# EAGLE design PCB_MASTER_CARRO_MYM (EAGLE 9.2.2)
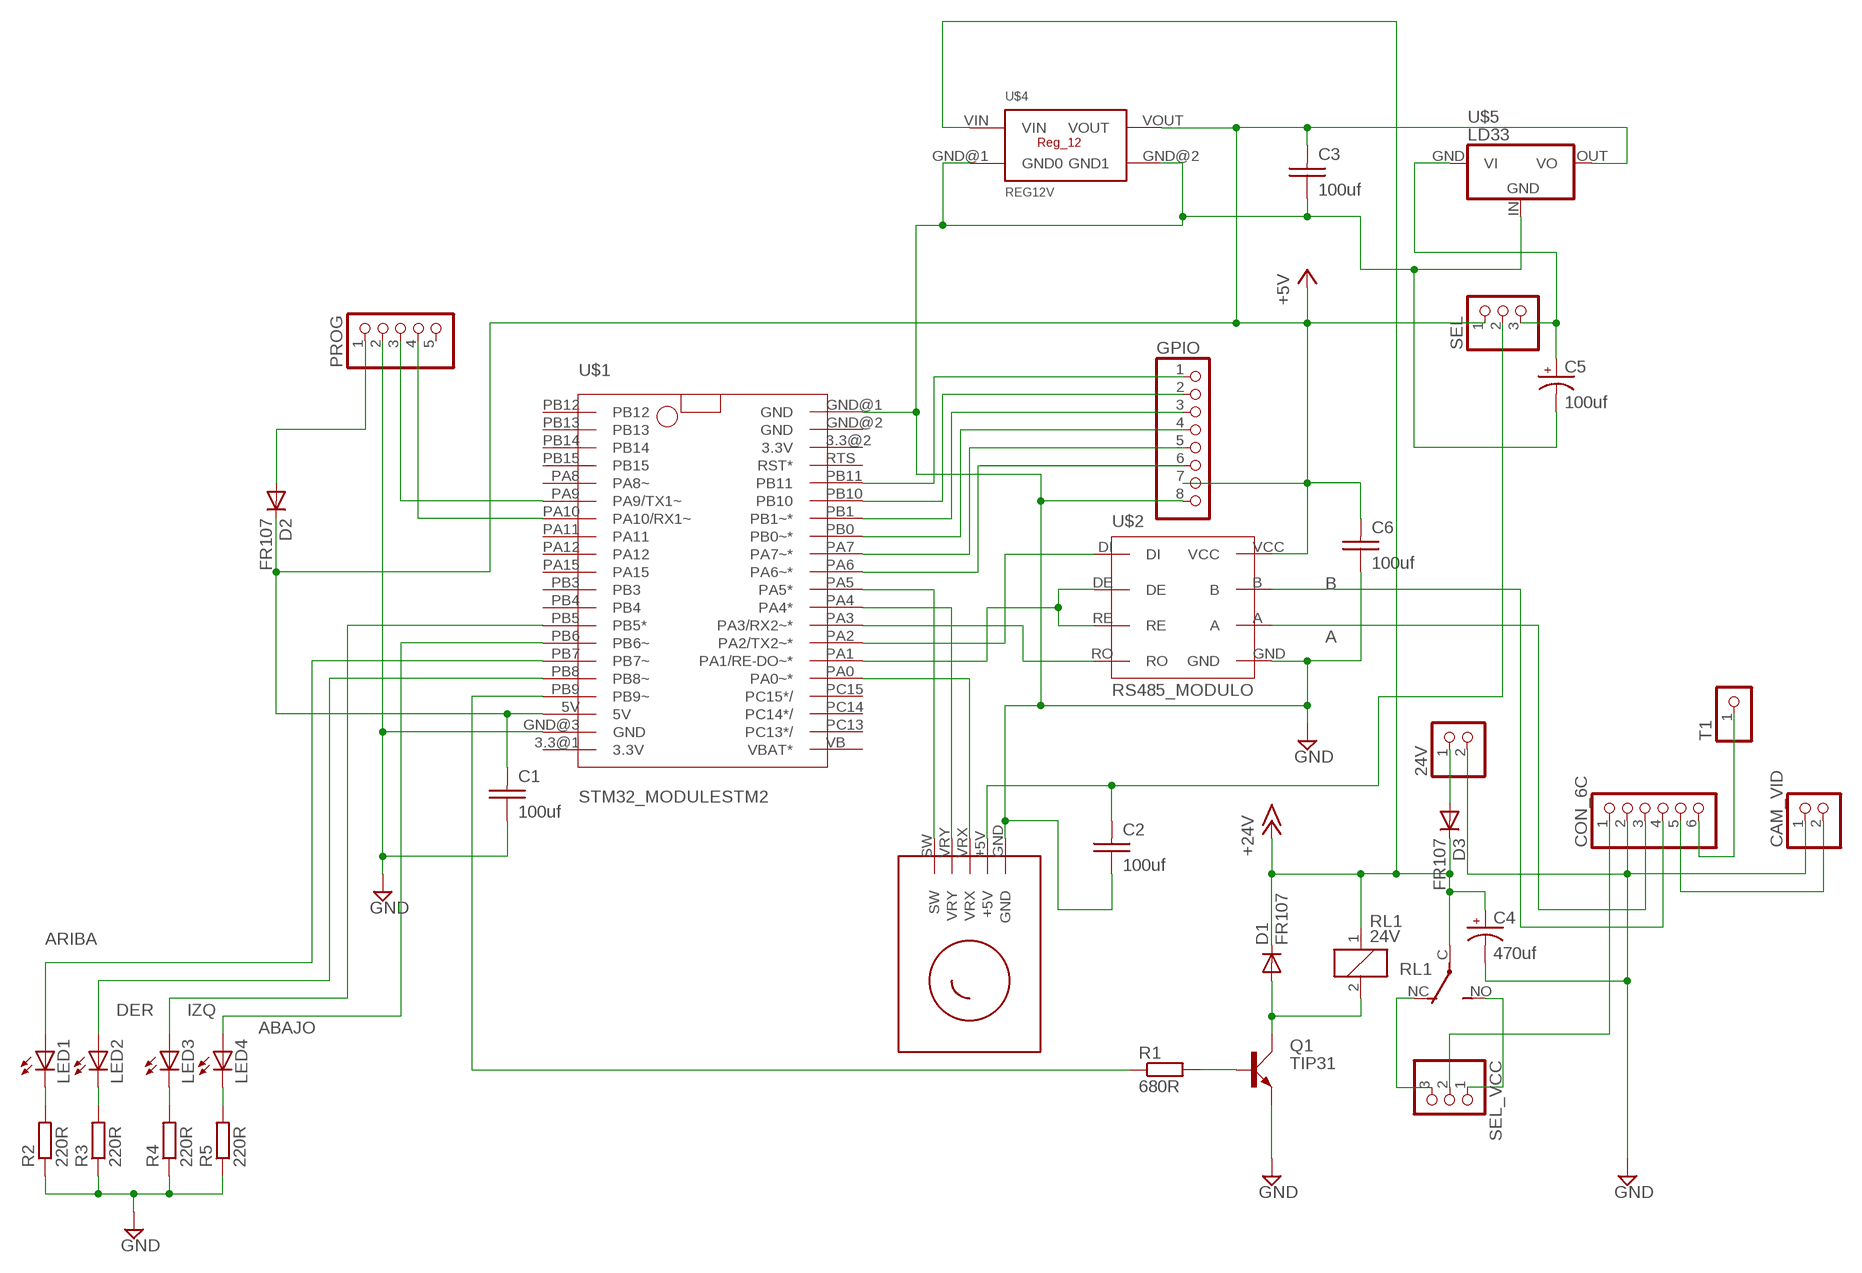
[diagram p0: schematic, sheet 1]

## Parts
24V  PINHD-1X2  [1X02]
C1  100uf  CAP_CERAMICO_TH2  [CAP_CER_2,54-5X5]
C2  100uf  CAP_CERAMICO_TH2  [CAP_CER_2,54-5X5]
C3  100uf  CAP_CERAMICO_TH2  [CAP_CER_2,54-5X5]
C4  470uf  CAP_POLARIZADOCAP_T5-8,5  [CAP_T_5-D8,5]
C5  100uf  CAP_POLARIZADOCAP_T3,5-D8  [CAP_T_3,5-D8]
C6  100uf  CAP_CERAMICO_TH2  [CAP_CER_2,54-5X5]
CAM_VID  PINHD-1X2  [1X02]
CON_6C  PINHD-1X6  [1X06]
D1  FR107  DIODOT_5  [D-5]
D2  FR107  DIODO  [DIODO4MM]
D3  FR107  DIODO  [DIODO4MM]
GPIO  PINHD-1X8  [1X08]
LED1  LEDLED_T_3MM  [LED3MM]
LED2  LEDLED_T_3MM  [LED3MM]
LED3  LEDLED_T_3MM  [LED3MM]
LED4  LEDLED_T_3MM  [LED3MM]
PROG  PINHD-1X5  [1X05]
Q1  TIP31  TIP48_TH  [TO220]
R1  680R  RESISTORT_LARGO  [0204/5]
R2  220R  RESISTORT_LARGO  [0204/5]
R3  220R  RESISTORT_LARGO  [0204/5]
R4  220R  RESISTORT_LARGO  [0204/5]
R5  220R  RESISTORT_LARGO  [0204/5]
RL1  24V  CQ1-12V  [CQ1]
SEL  PINHD-1X3  [1X03]
SEL_VCC  PINHD-1X3  [1X03]
T1  PINHD-1X1  [1X01]
U$1  STM32_MODULESTM2  [STM_32MOD]
U$2  RS485_MODULO  [RS485_FP]
U$3  JOYSTICK  [JOYSTICK]
U$4  REG12V  [REG12V]
U$5  LD33  [78XXS]

## Nets
+5V: C1.1 C3.1 C6.1 D2.C GPIO.7 SEL.1 U$1.5V U$2.VCC U$4.VOUT U$5.OUT(VO)
+15V: C4.+ D1.C D3.C RL1.1 RL1.C(2:P) U$4.VIN ; supply symbol labelled +24V
A: CON_6C.3 U$2.A
ABAJO: LED4.A U$1.PB6(PB6~)
ARIBA: LED1.A U$1.PB7(PB7~)
B: CON_6C.4 U$2.B
DER: LED2.A U$1.PB8(PB8~)
GND: 24V.2 C1.2 C2.2 C3.2 C4.- C5.- C6.2 CAM_VID.1 CON_6C.2 GPIO.8 PROG.2 Q1.E R2.1 R3.1 R4.1 R5.1 U$1.GND@1(GND) U$1.GND@3(GND) U$2.GND U$3.GND U$4.GND@1(GND0) U$4.GND@2(GND1) U$5.IN(GND)
IZQ: LED3.A U$1.PB5(PB5*)
N$1: C5.+ SEL.3 U$5.GND(VI)
N$2: LED1.K(C) R2.2
N$3: LED2.K(C) R3.2
N$4: LED3.K(C) R4.2
N$5: LED4.K(C) R5.2
N$6: 24V.1 D3.A
N$9: U$1.PA1(PA1/RE-DO~*) U$2.DE U$2.RE
N$10: U$1.PA2(PA2/TX2~*) U$2.DI
N$11: U$1.PA3(PA3/RX2~*) U$2.RO
N$12: D1.A Q1.C RL1.2
N$13: C2.1 SEL.2 U$3.+5V
N$14: Q1.B R1.2
N$15: R1.1 U$1.PB9(PB9~)
N$16: RL1.NC(2:O) SEL_VCC.3
N$17: CAM_VID.2 CON_6C.5
N$18: RL1.NO(2:S) SEL_VCC.1
N$19: CON_6C.1 SEL_VCC.2
N$20: GPIO.6 U$1.PA6(PA6~*)
N$21: GPIO.5 U$1.PA7(PA7~*)
N$22: GPIO.4 U$1.PB0(PB0~*)
N$23: GPIO.3 U$1.PB1(PB1~*)
N$24: GPIO.2 U$1.PB10
N$25: GPIO.1 U$1.PB11
N$29: D2.A PROG.1
N$30: CON_6C.6 T1.1
RX-TX_A9: PROG.3 U$1.PA9(PA9/TX1~)
SW: U$1.PA0(PA0~*) U$3.VRX
TX-RX_A10: PROG.4 U$1.PA10(PA10/RX1~)
VRX: U$1.PA5(PA5*) U$3.SW
VRY: U$1.PA4(PA4*) U$3.VRY
Unconnected: PROG.5 U$1.3.3@1(3.3V) U$1.3.3@2(3.3V) U$1.GND@2(GND) U$1.PA8(PA8~) U$1.PA11 U$1.PA12 U$1.PA15 U$1.PB3 U$1.PB4 U$1.PB12 U$1.PB13 U$1.PB14 U$1.PB15 U$1.PC13(PC13*/) U$1.PC14(PC14*/) U$1.PC15(PC15*/) U$1.RTS(RST*) U$1.VB(VBAT*)

## Library data of the parts
24V CAM_VID = pinhead:PINHD-1X2: PIN HEADER
C1-C3 C6 = 7DI Library:CAP_CERAMICO: Capacitores ceramicos y de poliester, entre otros
C4 C5 = 7DI Library:CAP_POLARIZADO: Capacitor para el dac de 2.2uf
CON_6C = pinhead:PINHD-1X6: PIN HEADER
D1-D3 = 7DI Library:DIODO: Diodo usado para protecion en las fuentes de alimentacion
GPIO = pinhead:PINHD-1X8: PIN HEADER
LED1-LED4 = 7DI Library:LED: Diodo led de 3, 5 mm y SMD 0805
PROG = pinhead:PINHD-1X5: PIN HEADER
Q1 = 7DI Library:TIP48: NPN TRANSISTOR
R1-R5 = 7DI Library:RESISTOR: Resistor con varias variantes
RL1 = relay:CQ1-12V: AUTOMOTIVE QUIET RELAY NAiS Source: http://www.mew-europe.com/.. en_ds_61208_0000.pdf; OC_FARNELL: unknown; OC_NEWARK: unknown
SEL SEL_VCC = pinhead:PINHD-1X3: PIN HEADER
T1 = pinhead:PINHD-1X1: PIN HEADER
U$1 = arduino_nano:STM32_MODULE: Blue pill is the nickname given to the most popular, ultra-cheap and compact STM32F103 board. The STMicroelectronics STM32F103C8 is an ARM 32-bit Cortex-M3 Microcontroller, 72MHz, 64kB Flash, 20kB SRAM, PLL, Embedded Internal RC 8MHz and 32kHz, Real-Time Clock, Nested Interrupt Controller, Power Saving Modes, JTAG and SWD, 3 Synch. 16-bit Timers with Input Capture, Output Compare and PWM, 16-bit 6-ch Advanced Timer, 2 16-bit Watchdog Timers, SysTick Timer, 2 SPI, 2 I2C, 3 USART, USB 2.0 Full Speed Interface, CAN 2.0B Active, 2 12-bit 10-ch A/D Converter, Fast I/O Ports.
U$2 = RS485_MODULO:RS485_MODULO: RS485 MODULO by Meduag
U$3 = arduino_nano:JOYSTICK
U$4 = arduino_nano:REG12V
U$5 = 7DI Library:LD33

## Net classes
1 GND: width 0.508 mm

## Board
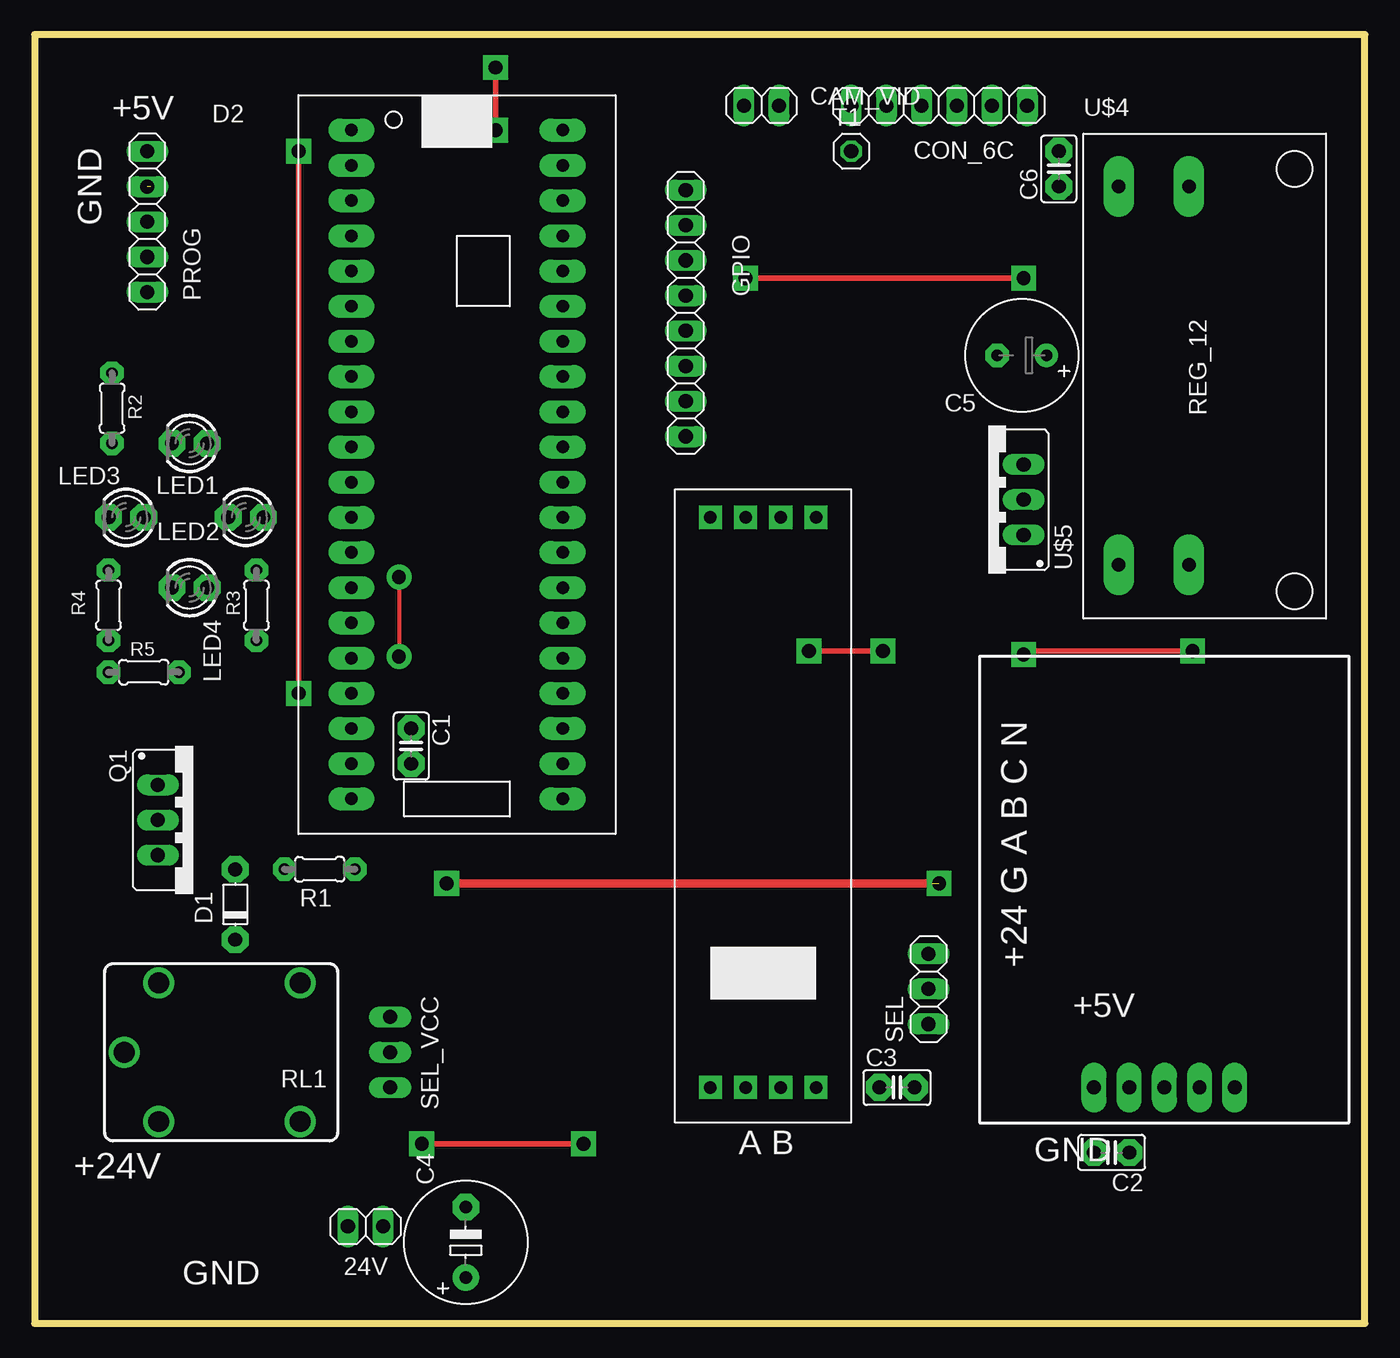
[diagram p1: board, top side]
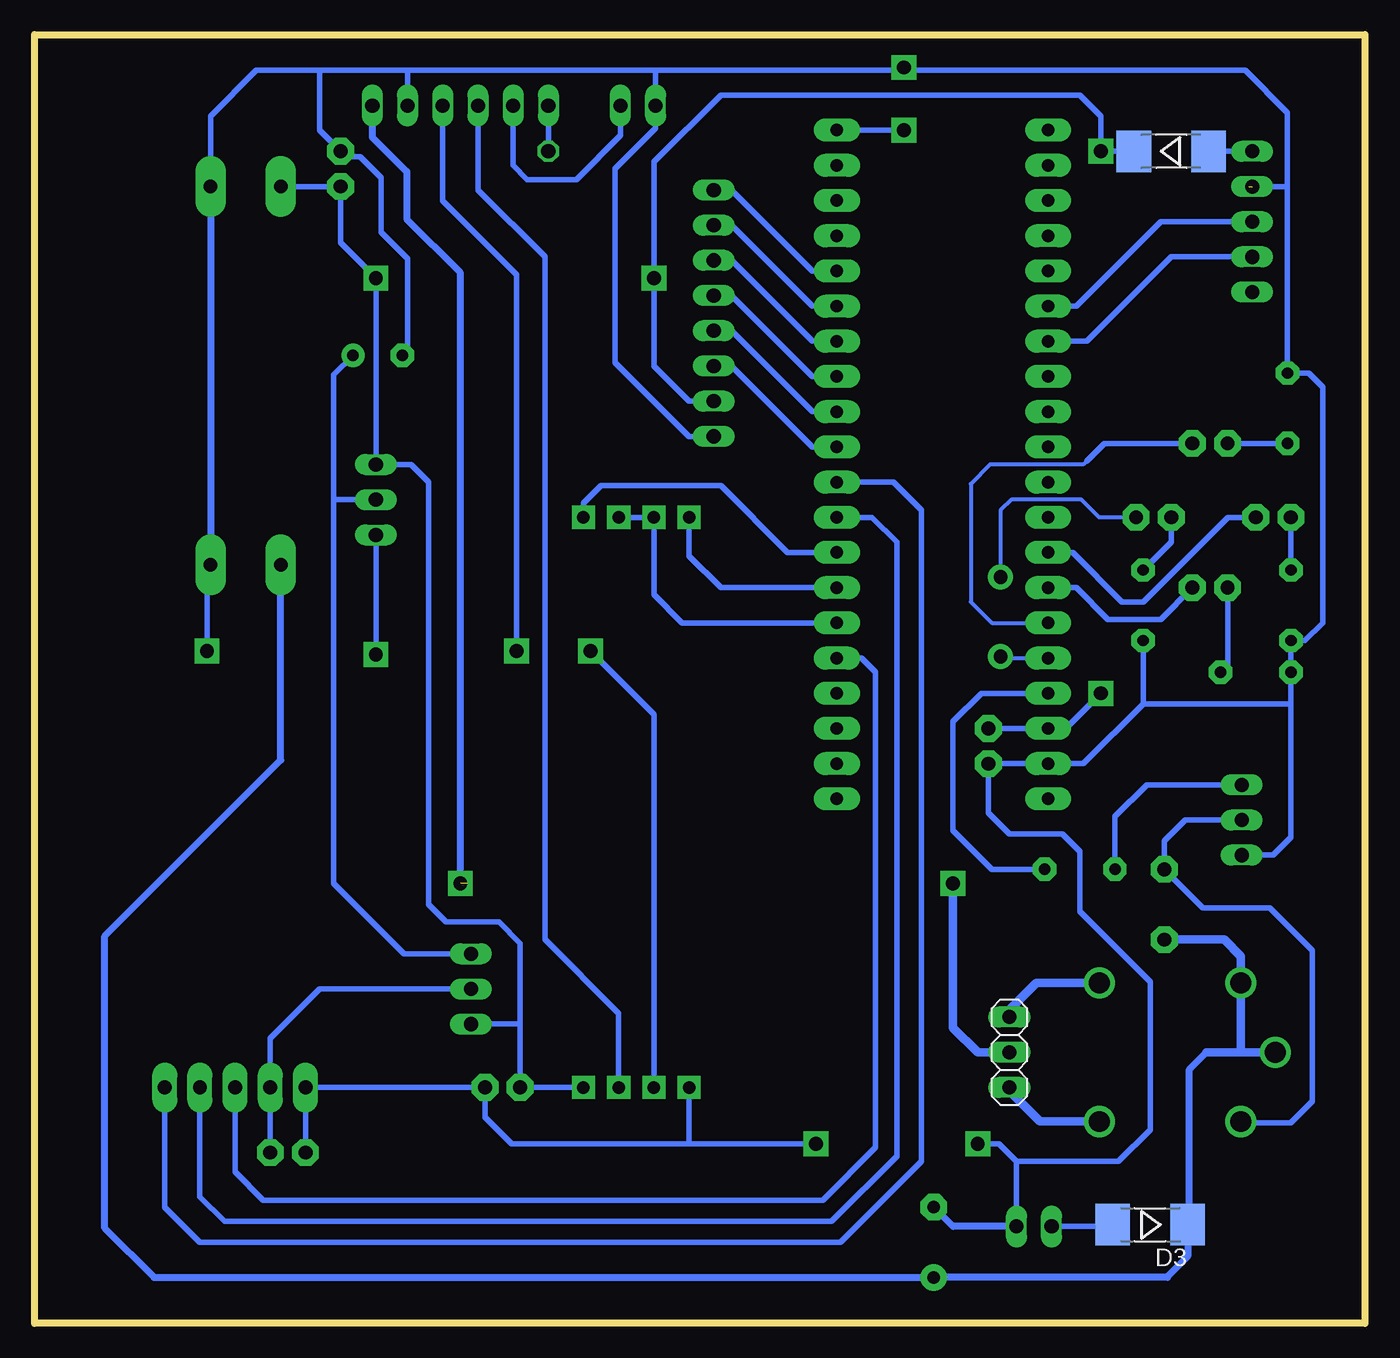
[diagram p2: board, bottom side, seen from below]

Size 96 x 93 mm. Coordinates in mm from the lower left corner, seen from the top.
Outline: 0,0 96,0 96,93 0,93 0,0
Copper layers (1*16): Top 0.035mm / dielectric 1.5mm / Bottom 0.035mm
Design rules "default *": minimum track width 6mil, minimum drill 0.35mm, track to track 10mil, track to pad 10mil, pad to pad 6mil, via to via 6mil, smd to smd 6mil, copper to edge 40mil, drill to drill 6mil, minimum pad ring 10mil, minimum via ring 8mil, stop-mask expansion 4mil, vias tented up to drill 0mil, thermal gap 10mil

### Footprints (pad centres in the part's own frame; a part is rotated, then mirrored left to right if it is on the bottom)
1X02 = drill 1.016 long: 1 -1.27,0; 2 1.27,0
CAP_CER_2,54-5X5 = drill 1 pad 1.93 octagon: 1 -1.27,0; 2 1.27,0
CAP_T_5-D8,5 = drill 0.9 pad 1.93: + -2.54,0 | drill 0.9 pad 1.93 octagon: - 2.54,0
CAP_T_3,5-D8 = drill 0.813 pad 1.676: + -1.778,0 | drill 0.813 pad 1.676 octagon: - 1.778,0
1X06 = drill 1.016 long: 1 -6.35,0; 2 -3.81,0; 3 -1.27,0; 4 1.27,0; 5 3.81,0; 6 6.35,0
D-5 = drill 1 pad 1.93 octagon: A 2.54,0; C -2.54,0
DIODO4MM = smd 2.5 x 3: A 2.7,0; C -2.7,0
1X08 = drill 1.016 long: 1 -8.89,0; 2 -6.35,0; 3 -3.81,0; 4 -1.27,0; 5 1.27,0; 6 3.81,0; 7 6.35,0; 8 8.89,0
LED3MM = drill 1 pad 1.93 octagon: A -1.27,0; K 1.27,0
1X05 = drill 1.016 long: 1 -5.08,0; 2 -2.54,0; 3 0,0; 4 2.54,0; 5 5.08,0
TO220 = drill 1.016 long: B -2.54,0; C 0,0; E 2.54,0
0204/5 = drill 0.813 pad 1.676 octagon: 1 -2.54,0; 2 2.54,0
CQ1 = drill 1.5: 1 4.5,-5; 2 4.5,5; C 7,0; NC -5.7,-5; NO -5.7,5
1X03 = drill 1.016 long: 1 -2.54,0; 2 0,0; 3 2.54,0
1X01 = drill 1.016 octagon: 1 0,0
STM_32MOD = drill 0.9 pad 1.676 long: 3.3@1 -7.62,-24.13; 3.3@2 7.62,19.05; 5V -7.62,-19.05; GND@1 7.62,24.13; GND@2 7.62,21.59; GND@3 -7.62,-21.59; PA0 7.62,-13.97; PA1 7.62,-11.43; PA2 7.62,-8.89; PA3 7.62,-6.35; PA4 7.62,-3.81; PA5 7.62,-1.27; PA6 7.62,1.27; PA7 7.62,3.81; PA8 -7.62,13.97; PA9 -7.62,11.43; PA10 -7.62,8.89; PA11 -7.62,6.35; PA12 -7.62,3.81; PA15 -7.62,1.27; PB0 7.62,6.35; PB1 7.62,8.89; PB3 -7.62,-1.27; PB4 -7.62,-3.81; PB5 -7.62,-6.35; PB6 -7.62,-8.89; PB7 -7.62,-11.43; PB8 -7.62,-13.97; PB9 -7.62,-16.51; PB10 7.62,11.43; PB11 7.62,13.97; PB12 -7.62,24.13; PB13 -7.62,21.59; PB14 -7.62,19.05; PB15 -7.62,16.51; PC13 7.62,-21.59; PC14 7.62,-19.05; PC15 7.62,-16.51; RTS 7.62,16.51; VB 7.62,-24.13
RS485_FP = drill 0.9 pad 1.676 square: A -20.32,1.27; B -20.32,-1.27; DE 20.828,1.27; DI 20.828,3.81; GND -20.32,3.81; RE 20.828,-1.27; RO 20.828,-3.81; VCC -20.32,-3.81
JOYSTICK = drill 1 pad 1.8 long: +5V -2.54,0; GND -5.08,0; SW 5.08,0; VRX 0,0; VRY 2.54,0
REG12V = drill 1 pad 2.184 long: GND@1 7.62,-31.115; GND@2 7.62,-3.81; VIN 2.54,-31.115; VOUT 2.54,-3.81
78XXS = drill 1.016 long: GND 0,-2.54; IN -2.54,-2.54; OUT 2.54,-2.54

### Placement (x,y rotation side)
24V  23.88,6.99 0 top
C1  27.18,41.66 270 top
C2  77.72,12.32 180 top
C3  62.23,17.02 0 top
C4  31.11,5.84 90 top
C5  71.25,69.85 180 top
C6  73.91,83.31 90 top
CAM_VID  52.45,87.88 0 top
CON_6C  65.28,87.88 180 top
D1  14.48,30.23 90 top
D2  13.97,84.58 0 bottom
D3  15.49,7.11 180 bottom
GPIO  46.99,72.9 270 top
LED1  11.18,63.5 180 top
LED2  15.24,58.17 180 top
LED3  6.6,58.17 180 top
LED4  11.18,53.09 180 top
PROG  8.13,79.5 270 top
Q1  8.89,36.32 270 top
R1  20.57,32.77 180 top
R2  5.59,66.04 270 top
R3  16,51.82 90 top
R4  5.33,51.82 90 top
R5  7.87,46.99 0 top
RL1  13.46,19.56 180 top
SEL  64.52,24.13 90 top
SEL_VCC  25.65,19.56 90 bottom
T1  58.93,84.58 0 top
U$1  30.48,61.98 0 top
U$2  52.58,37.34 90 top
U$3  81.53,17.02 0 top
U$4  75.69,85.85 0 top
U$5  68.83,59.44 90 top

### Tracks (layer width: path | path; a pad name or v marks a point on that pad's centre or on a via)
+5V  (via drill 1 pad 1.8)
  Top 0.406: v19.05,45.47 v19.05,84.58 | v71.37,75.44 v51.31,75.44
  Bottom 0.406: v19.05,45.47 21.59,42.93 U$1.5V C1.1 | D2.C v19.05,84.58 19.05,87.12 20.57,88.65 46.48,88.65 51.31,83.82 v51.31,75.44 51.31,69.09 48.77,66.55 GPIO.7 | 77.98,82.04 U$4.VOUT C6.1 73.91,77.98 v71.37,75.44 U$5.OUT 68.83,61.98 67.56,60.71 67.56,30.23 66.29,28.96 62.48,28.96 60.96,27.43 60.96,21.59 | SEL.1 60.96,21.59 | U$2.VCC C3.1 60.96,21.59
+15V
  Bottom 0.406: 8.96,19.63 8.89,19.56
  Bottom 0.508: U$4.VIN 78.23,40.64 90.93,27.94 90.93,6.86 87.38,3.3 C4.+ 14.22,3.3 14.22,3.4 12.79,4.83 D3.C 12.7,7.21 12.7,18.29 11.43,19.56
  Bottom 0.61: D1.C 10.16,27.69 8.96,26.49 RL1.1 8.96,19.63 | 11.43,19.56 8.89,19.56 RL1.C
A  (via drill 1 pad 1.8)
  Top 0.406: v55.88,48.51 v61.21,48.51
  Bottom 0.406: U$2.A 51.31,43.94 v55.88,48.51 | v61.21,48.51 61.21,75.69 66.55,81.03 CON_6C.3
ABAJO
  Bottom 0.406: U$1.PB6 20.83,53.09 18.54,50.8 14.73,50.8 LED4.A
ARIBA
  Bottom 0.305: 20.07,62.23 20.32,61.98 27.05,61.98 28.45,60.58 28.45,52.07 26.92,50.55 U$1.PB7
  Bottom 0.406: 20.07,62.23 18.8,63.5 LED1.A
B
  Bottom 0.406: CON_6C.4 64.01,81.79 59.18,76.96 59.18,27.69 53.85,22.35 U$2.B
DER  (via drill 1 pad 1.8)
  Top 0.305: v26.29,53.85 v26.29,48.13
  Bottom 0.305: LED2.A 19.18,58.17 20.45,59.44 25.53,59.44 26.29,58.67 v26.29,53.85 | v26.29,48.13 26.16,48.01 U$1.PB8
GND  (via drill 1 pad 1.8)  (1 unrouted)
  Top 0.406: v33.27,86.11 v33.27,90.63 | v83.57,48.51 71.63,48.51 v71.37,48.26 | v27.94,12.95 v39.62,12.95
  Bottom 0.406: 16,44.7 R3.1 | 16,44.7 20.32,40.39 U$1.GND@3 C1.2 27.18,36.83 25.65,35.31 21.84,35.31 20.57,34.04 20.57,29.72 15.49,24.64 15.49,13.97 17.78,11.68 25.15,11.68 | Q1.E 6.6,33.78 5.33,35.05 5.33,44.7 | 5.33,44.7 R5.1 R4.1 4.32,49.28 3.05,50.55 3.05,67.56 4.06,68.58 R2.1 5.59,82.04 | 16,44.7 5.33,44.7 | 48.64,16.89 U$2.GND 48.77,12.95 | GPIO.8 48.77,64.01 54.1,69.34 54.1,83.31 51.18,86.23 CAM_VID.1 51.18,90.3 51.31,90.42 | 5.59,82.04 5.59,87.38 8.64,90.42 33.07,90.42 v33.27,90.63 33.48,90.42 51.31,90.42 | 8.38,82.04 5.59,82.04 | 48.77,12.95 61.59,12.95 63.5,14.86 C3.2 U$3.GND C2.2 | U$1.GND@1 v33.27,86.11 | U$4.GND@2 83.31,87.12 80.01,90.42 75.44,90.42 | 51.31,90.42 69.09,90.42 | 69.09,90.42 75.44,90.42 | CON_6C.2 69.09,90.42 | U$4.GND@1 83.57,54.48 v83.57,48.51 | v71.37,48.26 U$5.IN | 24V.2 25.15,11.68 | 75.44,90.42 75.44,86.11 C6.2 73.53,84.2 72.52,84.2 70.99,82.68 70.99,78.74 69.09,76.83 69.09,70.23 C5.- | 25.15,11.68 26.42,12.95 v27.94,12.95 | 48.77,12.95 v39.62,12.95
  Bottom 0.508: U$4.GND@2 U$4.GND@1 | 24V.2 29.72,6.99 C4.-
  cutout Bottom: 1,92 95,92 95,1 1,1
IZQ
  Bottom 0.406: U$1.PB5 21.08,55.63 17.53,52.07 16,52.07 9.91,58.17 LED3.A
N$1
  Bottom 0.406: SEL.3 69.34,26.67 74.42,31.75 74.42,59.44 | U$5.GND 74.42,59.44 | C5.+ 74.42,68.45 74.42,59.44
N$2
  Bottom 0.406: LED1.K R2.2
N$3
  Bottom 0.406: LED2.K 13.97,56.39 R3.2
N$4
  Bottom 0.406: LED3.K R4.2
N$5
  Bottom 0.406: LED4.K 9.91,47.5 R5.2
N$6
  Bottom 0.406: 24V.1 18.32,6.99 D3.A
N$9
  Bottom 0.406: U$1.PA1 49.28,50.55 51.31,52.58 U$2.DE U$2.RE
N$10
  Bottom 0.406: U$1.PA2 46.48,53.09 48.77,55.37 U$2.DI
N$11
  Bottom 0.406: U$1.PA3 41.66,55.63 46.48,60.45 55.12,60.45 56.39,59.18 U$2.RO
N$12
  Bottom 0.406: Q1.C 12.95,36.32 14.48,34.8 D1.A 11.68,29.97 6.86,29.97 3.81,26.92 3.81,16 5.33,14.48 8.88,14.48 RL1.2
N$13
  Bottom 0.406: SEL.2 75.44,24.13 78.99,20.57 U$3.+5V C2.1
N$14
  Bottom 0.406: Q1.B 15.75,38.86 18.03,36.58 R1.2
N$15
  Bottom 0.406: U$1.PB9 27.69,45.47 29.72,43.43 29.72,35.56 26.92,32.77 R1.1
N$16
  Bottom 0.61: RL1.NC 23.7,24.56 25.65,22.61 SEL_VCC.3
N$17
  Bottom 0.406: CAM_VID.2 53.72,85.72 56.9,82.55 60.45,82.55 61.47,83.57 CON_6C.5
N$18
  Bottom 0.61: SEL_VCC.1 25.65,16.76 23.45,14.56 RL1.NO
N$19  (via drill 1 pad 1.8)  (1 unrouted)
  Top 0.61: 64.77,31.75 v29.72,31.75
  Bottom 0.508: v65.28,31.75 65.28,75.82 69.15,79.69 69.15,83.12 71.63,85.6 CON_6C.1
  Bottom 0.61: SEL_VCC.2 27.94,19.56 29.72,21.34 v29.72,31.75
N$20
  Bottom 0.406: U$1.PA6 39.88,63.25 45.72,69.09 GPIO.6
N$21
  Bottom 0.406: U$1.PA7 39.88,65.79 45.72,71.63 GPIO.5
N$22
  Bottom 0.406: U$1.PB0 39.88,68.33 45.72,74.17 GPIO.4
N$23
  Bottom 0.406: U$1.PB1 39.88,70.87 45.72,76.71 GPIO.3
N$24
  Bottom 0.406: U$1.PB10 39.88,73.41 45.72,79.25 GPIO.2
N$25
  Bottom 0.406: U$1.PB11 39.88,75.95 45.72,81.79 GPIO.1
N$29
  Bottom 0.406: PROG.1 D2.A
N$30
  Bottom 0.406: CON_6C.6 T1.1
RX-TX_A9
  Bottom 0.406: U$1.PA9 20.83,73.41 14.73,79.5 PROG.3
SW
  Bottom 0.406: U$1.PA0 36.32,48.01 35.31,46.99 35.31,12.7 39.12,8.89 79.5,8.89 81.53,10.92 U$3.VRX
TX-RX_A10
  Bottom 0.406: U$1.PA10 20.07,70.87 13.97,76.96 PROG.4
VRX
  Bottom 0.406: U$3.SW 86.61,8.38 84.07,5.84 37.85,5.84 32,11.68 32,58.67 34.04,60.71 U$1.PA5
VRY
  Bottom 0.406: U$3.VRY 84.07,9.14 82.3,7.37 38.48,7.37 33.78,12.06 33.78,56.39 35.56,58.17 U$1.PA4

### Text on the board
tPlace: +5V | GND | +24 G A B C N | +5V | A B | GND | +24V | GND